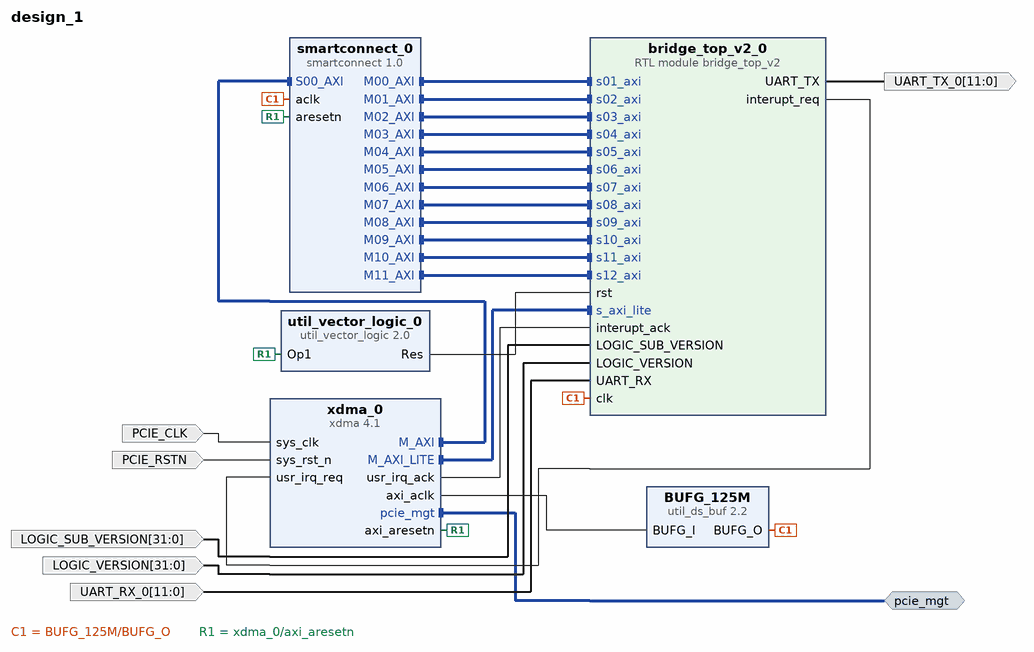
[diagram p0: block diagram of the top level]
# Vivado block design design_1, xc7a200tfbg676-2, Vivado 2022.2
create_bd_design design_1

create_bd_intf_port -mode Master -vlnv xilinx.com:interface:pcie_7x_mgt_rtl:1.0 pcie_mgt
create_bd_port -dir I -from 31 -to 0 LOGIC_SUB_VERSION
create_bd_port -dir I -from 31 -to 0 LOGIC_VERSION
create_bd_port -dir I -type clk PCIE_CLK
create_bd_port -dir I -type rst PCIE_RSTN
create_bd_port -dir I -from 11 -to 0 UART_RX_0
create_bd_port -dir O -from 11 -to 0 UART_TX_0

create_bd_cell -type ip -vlnv xilinx.com:ip:util_ds_buf:2.2 BUFG_125M
set_property -dict {CONFIG.C_BUF_TYPE BUFG} [get_bd_cells BUFG_125M]
create_bd_cell -type ip -vlnv xilinx.com:ip:util_vector_logic:2.0 util_vector_logic_0
set_property -dict {CONFIG.C_OPERATION not CONFIG.C_SIZE 1} [get_bd_cells util_vector_logic_0]
create_bd_cell -type ip -vlnv xilinx.com:ip:xdma:4.1 xdma_0
set_property -dict [list \
  CONFIG.axilite_master_en true \
  CONFIG.mode_selection Advanced \
  CONFIG.pf0_msi_enabled false \
  CONFIG.pl_link_cap_max_link_speed 5.0_GT/s \
  CONFIG.pl_link_cap_max_link_width X2 \
] [get_bd_cells xdma_0]
create_bd_cell -type ip -vlnv xilinx.com:ip:smartconnect:1.0 smartconnect_0
set_property -dict {CONFIG.NUM_MI 12 CONFIG.NUM_SI 1} [get_bd_cells smartconnect_0]
create_bd_cell -type module -reference bridge_top_v2 bridge_top_v2_0

# ---- connections ----

connect_bd_intf_net [get_bd_intf_pins smartconnect_0/M00_AXI] [get_bd_intf_pins bridge_top_v2_0/s01_axi]
connect_bd_intf_net [get_bd_intf_pins smartconnect_0/M01_AXI] [get_bd_intf_pins bridge_top_v2_0/s02_axi]
connect_bd_intf_net [get_bd_intf_pins smartconnect_0/M02_AXI] [get_bd_intf_pins bridge_top_v2_0/s03_axi]
connect_bd_intf_net [get_bd_intf_pins smartconnect_0/M03_AXI] [get_bd_intf_pins bridge_top_v2_0/s04_axi]
connect_bd_intf_net [get_bd_intf_pins smartconnect_0/M04_AXI] [get_bd_intf_pins bridge_top_v2_0/s05_axi]
connect_bd_intf_net [get_bd_intf_pins smartconnect_0/M05_AXI] [get_bd_intf_pins bridge_top_v2_0/s06_axi]
connect_bd_intf_net [get_bd_intf_pins smartconnect_0/M06_AXI] [get_bd_intf_pins bridge_top_v2_0/s07_axi]
connect_bd_intf_net [get_bd_intf_pins smartconnect_0/M07_AXI] [get_bd_intf_pins bridge_top_v2_0/s08_axi]
connect_bd_intf_net [get_bd_intf_pins smartconnect_0/M08_AXI] [get_bd_intf_pins bridge_top_v2_0/s09_axi]
connect_bd_intf_net [get_bd_intf_pins smartconnect_0/M09_AXI] [get_bd_intf_pins bridge_top_v2_0/s10_axi]
connect_bd_intf_net [get_bd_intf_pins smartconnect_0/M10_AXI] [get_bd_intf_pins bridge_top_v2_0/s11_axi]
connect_bd_intf_net [get_bd_intf_pins smartconnect_0/M11_AXI] [get_bd_intf_pins bridge_top_v2_0/s12_axi]
connect_bd_intf_net [get_bd_intf_pins smartconnect_0/S00_AXI] [get_bd_intf_pins xdma_0/M_AXI]
connect_bd_intf_net [get_bd_intf_pins bridge_top_v2_0/s_axi_lite] [get_bd_intf_pins xdma_0/M_AXI_LITE]
connect_bd_intf_net [get_bd_intf_ports pcie_mgt] [get_bd_intf_pins xdma_0/pcie_mgt]
connect_bd_net [get_bd_pins BUFG_125M/BUFG_O] [get_bd_pins smartconnect_0/aclk] [get_bd_pins bridge_top_v2_0/clk]
connect_bd_net -net LOGIC_SUB_VERSION_0_1 [get_bd_ports LOGIC_SUB_VERSION] [get_bd_pins bridge_top_v2_0/LOGIC_SUB_VERSION]
connect_bd_net -net LOGIC_VERSION_0_1 [get_bd_ports LOGIC_VERSION] [get_bd_pins bridge_top_v2_0/LOGIC_VERSION]
connect_bd_net -net UART_RX_0_1 [get_bd_ports UART_RX_0] [get_bd_pins bridge_top_v2_0/UART_RX]
connect_bd_net [get_bd_pins bridge_top_v2_0/UART_TX] [get_bd_ports UART_TX_0]
connect_bd_net [get_bd_pins bridge_top_v2_0/interupt_req] [get_bd_pins xdma_0/usr_irq_req]
connect_bd_net -net sys_clk_0_1 [get_bd_ports PCIE_CLK] [get_bd_pins xdma_0/sys_clk]
connect_bd_net -net sys_rst_n_0_1 [get_bd_ports PCIE_RSTN] [get_bd_pins xdma_0/sys_rst_n]
connect_bd_net [get_bd_pins util_vector_logic_0/Res] [get_bd_pins bridge_top_v2_0/rst]
connect_bd_net [get_bd_pins xdma_0/axi_aclk] [get_bd_pins BUFG_125M/BUFG_I]
connect_bd_net [get_bd_pins xdma_0/axi_aresetn] [get_bd_pins util_vector_logic_0/Op1] [get_bd_pins smartconnect_0/aresetn]
connect_bd_net [get_bd_pins xdma_0/usr_irq_ack] [get_bd_pins bridge_top_v2_0/interupt_ack]

# ---- address map ----
assign_bd_address -offset 0x0000000000110000 -range 64K -target_address_space [get_bd_addr_spaces xdma_0/M_AXI] [get_bd_addr_segs bridge_top_v2_0/s01_axi/reg0]
assign_bd_address -offset 0x0000000000120000 -range 64K -target_address_space [get_bd_addr_spaces xdma_0/M_AXI] [get_bd_addr_segs bridge_top_v2_0/s02_axi/reg0]
assign_bd_address -offset 0x0000000000130000 -range 64K -target_address_space [get_bd_addr_spaces xdma_0/M_AXI] [get_bd_addr_segs bridge_top_v2_0/s03_axi/reg0]
assign_bd_address -offset 0x0000000000140000 -range 64K -target_address_space [get_bd_addr_spaces xdma_0/M_AXI] [get_bd_addr_segs bridge_top_v2_0/s04_axi/reg0]
assign_bd_address -offset 0x0000000000150000 -range 64K -target_address_space [get_bd_addr_spaces xdma_0/M_AXI] [get_bd_addr_segs bridge_top_v2_0/s05_axi/reg0]
assign_bd_address -offset 0x0000000000160000 -range 64K -target_address_space [get_bd_addr_spaces xdma_0/M_AXI] [get_bd_addr_segs bridge_top_v2_0/s06_axi/reg0]
assign_bd_address -offset 0x0000000000170000 -range 64K -target_address_space [get_bd_addr_spaces xdma_0/M_AXI] [get_bd_addr_segs bridge_top_v2_0/s07_axi/reg0]
assign_bd_address -offset 0x0000000000180000 -range 64K -target_address_space [get_bd_addr_spaces xdma_0/M_AXI] [get_bd_addr_segs bridge_top_v2_0/s08_axi/reg0]
assign_bd_address -offset 0x0000000000190000 -range 64K -target_address_space [get_bd_addr_spaces xdma_0/M_AXI] [get_bd_addr_segs bridge_top_v2_0/s09_axi/reg0]
assign_bd_address -offset 0x00000000001A0000 -range 64K -target_address_space [get_bd_addr_spaces xdma_0/M_AXI] [get_bd_addr_segs bridge_top_v2_0/s10_axi/reg0]
assign_bd_address -offset 0x00000000001B0000 -range 64K -target_address_space [get_bd_addr_spaces xdma_0/M_AXI] [get_bd_addr_segs bridge_top_v2_0/s11_axi/reg0]
assign_bd_address -offset 0x00000000001C0000 -range 64K -target_address_space [get_bd_addr_spaces xdma_0/M_AXI] [get_bd_addr_segs bridge_top_v2_0/s12_axi/reg0]
assign_bd_address -offset 0x00000000 -range 128K -target_address_space [get_bd_addr_spaces xdma_0/M_AXI_LITE] [get_bd_addr_segs bridge_top_v2_0/s_axi_lite/reg0]

validate_bd_design
save_bd_design
